# Altium project ESP32_Projet.PrjPcb
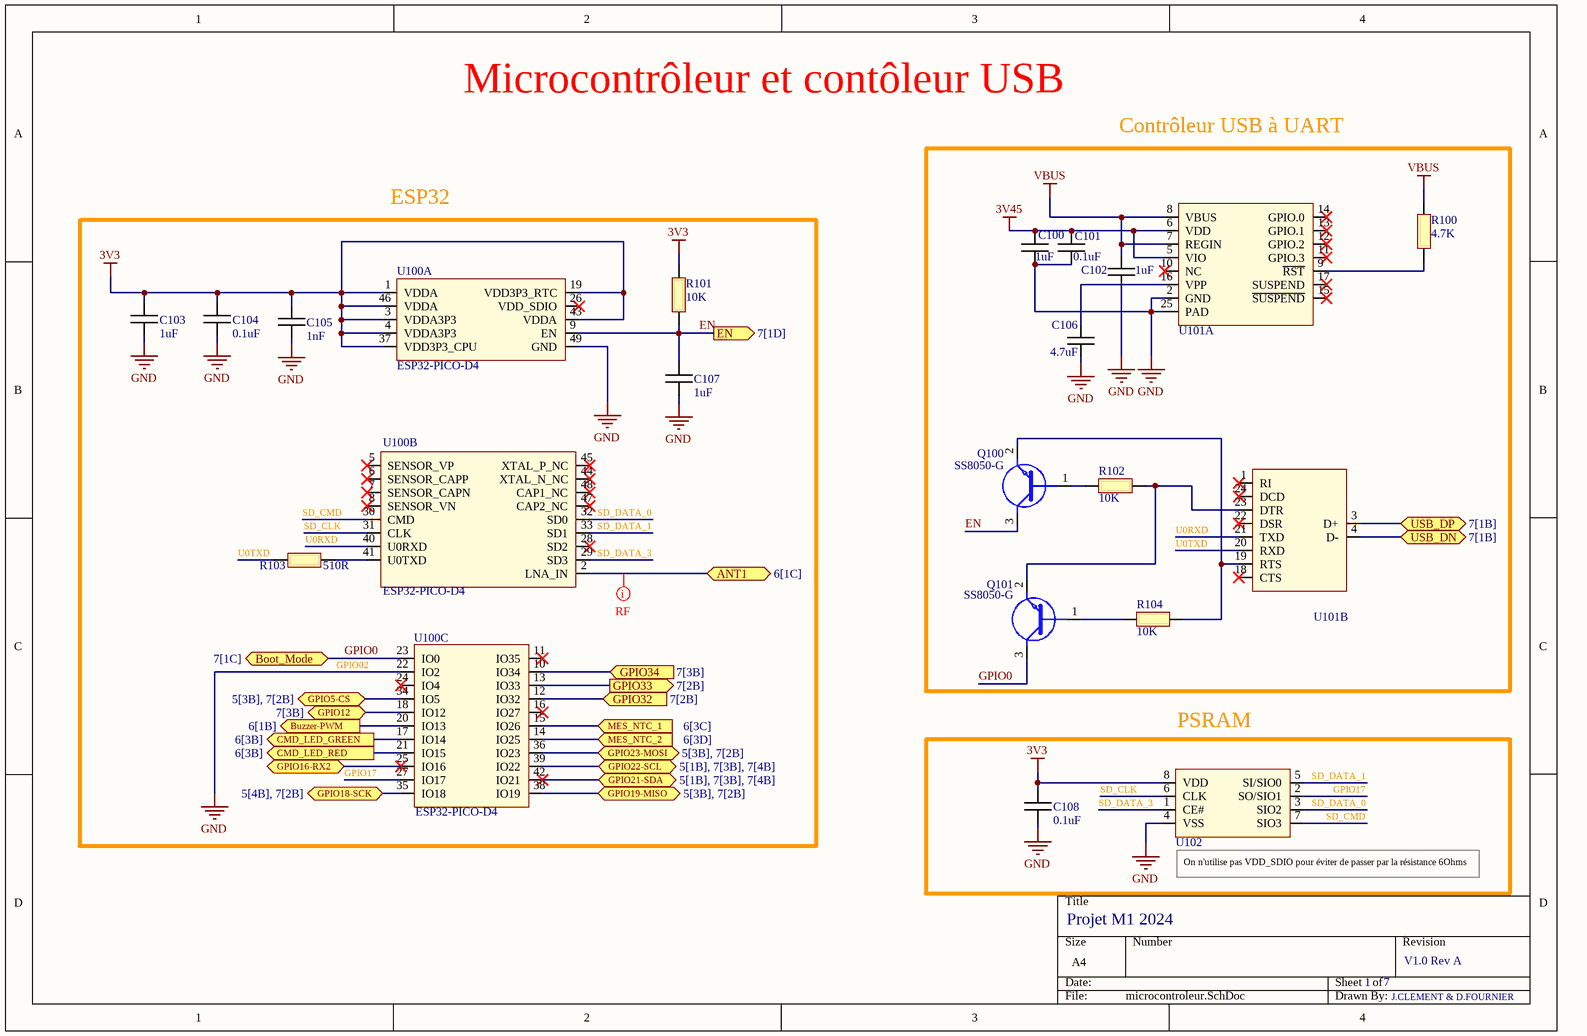
[diagram p0: microcontroleur.SchDoc]
7 sheets, 107 parts. Net scope: flat (ports and power ports of the same name join across sheets).
Board file: ESP32 V1.0.PcbDoc
Sheets:
  microcontroleur.SchDoc
  alimentation.SchDoc
  alim_logique_hard.SchDoc
  logique_hardware.SchDoc
  mesure_&_acquisition.SchDoc
  hmi.SchDoc
  connecteurs.SchDoc

## Sheet microcontroleur.SchDoc: Projet M1 2024
size A4; DrawnBy: J.CLEMENT & D.FOURNIER; DocumentNumber: 1; Revision: V1.0 Rev A; SheetNumber: 1; SheetTotal: 7

### Parts
C100  1uF  [CAPA_0603]
C101  0.1uF  [CAPA_0603]
C102  1uF  [CAPA_0603]
C103  1uF  [CAPA_0603]
C104  0.1uF  [CAPA_0603]
C105  1nF  [CAPA_0603]
C106  4.7uF  [CAPA_0603]
C107  1uF  [CAPA_0603]
C108  0.1uF  [CAPA_0603]
Q100  SS8050-G  [SS8050-G]
Q101  SS8050-G  [SS8050-G]
R100  4.7K  [RES_0603]
R101  10K  [RES_0603]
R102  10K  [RES_0603]
R103  510R  [RES_0603]
R104  10K  [RES_0603]
U100  ESP32-PICO-D4  [PQFN50P700X700X104_HS-49N]  (parts A,B,C of 3)
U101  CP2104-F03-GM  [PQFN50P400X400X80_HS-25N]  (value not drawn)  (parts A,B of 2)
U102  IS66WVS1M8BLL-104NLI  [SOIC127P600X175-8N]  (value not drawn)

### Blocks framed on the sheet
Contrôleur USB à UART: C100-C102 C106 Q100 Q101 R100 R102 R104 U101
ESP32: C103-C105 C107 R101 R103 U100
PSRAM: C108 U102

### Ports
ANT1 (bidir, see 6[1C]), Boot_Mode (bidir, see 7[1C]), Buzzer-PWM (out, see 6[1B]), CMD_LED_GREEN (out, see 6[3B]), CMD_LED_RED (out, see 6[3B]), EN (out, see 7[1D]), GPIO5-CS (bidir, see 5[3B], 7[2B]), GPIO12 (bidir, see 7[3B]), GPIO16-RX2 (bidir), GPIO18-SCK (bidir, see 5[4B], 7[2B]), GPIO19-MISO (bidir, see 5[3B], 7[2B]), GPIO21-SDA (bidir, see 5[1B], 7[3B], 7[4B]), GPIO22-SCL (bidir, see 5[1B], 7[3B], 7[4B]), GPIO23-MOSI (bidir, see 5[3B], 7[2B]), GPIO32 (in, see 7[2B]), GPIO33 (out, see 7[2B]), GPIO34 (in, see 7[3B]), MES_NTC_1 (in, see 6[3C]), MES_NTC_2 (in, see 6[3D]), USB_DN (bidir, see 7[1B]), USB_DP (bidir, see 7[1B])

### Nets
3V3: C103.1 C104.1 C105.1 C108.1 R101.2 U100.1(VDDA) U100.3(VDDA3P3) U100.4(VDDA3P3) U100.19(VDD3P3_RTC) U100.37(VDD3P3_CPU) U100.43(VDDA) U100.46(VDDA) U102.8(VDD)
3V45: C100.1 C101.1 U101.5(VIO) U101.6(VDD)
GND: C100.2 C101.2 C102.2 C103.2 C104.2 C105.2 C106.2 C107.2 C108.2 U100.22(IO2) U100.49(GND) U101.2(GND) U101.25(PAD) U102.4(VSS)
VBUS: C102.1 R100.2 U101.7(REGIN) U101.8(VBUS)
EN: C107.1 Q100.3(C) R101.1 U100.9(EN) ; port EN
GPIO0: Q101.3(C) U100.23(IO0) ; port Boot_Mode
GPIO17: U100.27(IO17) U102.2(SO/SIO1)
SD_CLK: U100.31(CLK) U102.6(CLK)
SD_CMD: U100.30(CMD) U102.7(SIO3)
SD_DATA_0: U100.32(SD0) U102.3(SIO2)
SD_DATA_1: U100.33(SD1) U102.5(SI/SIO0)
SD_DATA_3: U100.29(SD3) U102.1(CE#)
U0RXD: U100.40(U0RXD) U101.21(TXD)
U0TXD: R103.1 U101.20(RXD)
USB_D_N: U101.4(D-) ; port USB_DN
USB_D_P: U101.3(D+) ; port USB_DP
NetB500_4: U100.42(IO21) ; port GPIO21-SDA
NetB500_5: U100.39(IO22) ; port GPIO22-SCL
NetB501_1: U100.34(IO5) ; port GPIO5-CS
NetB501_3: U100.38(IO19) ; port GPIO19-MISO
NetB501_4: U100.35(IO18) ; port GPIO18-SCK
NetC106_1: C106.1 U101.16(VPP)
NetC600_1: U100.2(LNA_IN) ; port ANT1
NetC603_1: U100.15(IO26) ; port MES_NTC_1
NetC605_1: U100.14(IO25) ; port MES_NTC_2
NetD600_1: U100.17(IO14) ; port CMD_LED_GREEN
NetD600_3: U100.21(IO15) ; port CMD_LED_RED
NetJ200_1: U100.12(IO32) ; port GPIO32
NetJ200_2: U100.13(IO33) ; port GPIO33
NetJ200_6: U100.36(IO23) ; port GPIO23-MOSI
NetJ200_9: U100.18(IO12) ; port GPIO12
NetJ200_10: U100.10(IO34) ; port GPIO34
NetQ100_1: Q100.1(B) R102.1
NetQ100_2: Q100.2(E) R104.2 U101.19(RTS)
NetQ101_1: Q101.1(B) R104.1
NetQ101_2: Q101.2(E) R102.2 U101.23(DTR)
NetR100_1: R100.1 U101.9(~{RST})
NetR103_2: R103.2 U100.41(U0TXD)
NetR603_1: U100.20(IO13) ; port Buzzer-PWM
NetU100_25: U100.25(IO16) ; port GPIO16-RX2

Not connected (* = marked no-connect by the designer): U100 5(SENSOR_VP)* 6(SENSOR_CAPP)* 7(SENSOR_CAPN)* 8(SENSOR_VN)* 11(IO35)* 16(IO27)* 24(IO4)* 26(VDD_SDIO)* 28(SD2)* 44(XTAL_N_NC)* 45(XTAL_P_NC)* 47(CAP2_NC)* 48(CAP1_NC)*; U101 1(RI)* 10(NC)* 11(GPIO.3)* 12(GPIO.2)* 13(GPIO.1)* 14(GPIO.0)* 15(~{SUSPEND})* 17(SUSPEND)* 18(CTS)* 22(DSR)* 24(DCD)*

### Layout directives
rule Width Constraint [Pref Impedance = 50.00ohms    Min Impedance = 50.00ohms    Max Impedance = 50.00ohms]: NetC600_1

### Notes on the sheet
- Microcontrôleur et contôleur USB
- (near U100) GPIO02
- (near U102) On n'utilise pas VDD_SDIO pour éviter de passer par la résistance 6Ohms

### Library data of the parts
C100-C108 = Capacitor
  C103: Parameter 1: *
Q100 Q101 = SS8050-G: Bipolar Transistors - BJT NPN TRANSISTOR 1.5A 40V
R100-R104 = Resistor
U100 = ESP32: Système RF sur puce - SoC SIP module ESP32 with 4MByte Flash, Dual Core MCU, Wi-Fi & Bluetooth Combo, LGA48-pin, 7*7mm; Manufacturer 1: Espressif Systems; Supplier 1: Digi-Key; Supplier Part Number 1: 1904-1029-1-ND; Manufacturer Part Number 1: ESP32-PICO-D4
U101 = USBBridge: USB Bridge, USB to UART USB 2.0 UART Interface 24-QFN (4x4); Manufacturer 1: Silicon Labs; Supplier 1: Arrow Electronics; Supplier Part Number 1: CP2104-F03-GM; Manufacturer Part Number 1: CP2104-F03-GM
U102 = SRAM: SRAM 8Mb, SerialRAM, 2.7V-3.6V, 104MHz, 8 pin SOIC 150 mil, RoHS; Manufacturer 1: ISSI; Supplier 1: Digi-Key; Supplier Part Number 1: 706-IS66WVS1M8BLL-104NLI-ND; Manufactuer Part Number 1: IS66WVS1M8BLL-104NLI

## Sheet alimentation.SchDoc: Projet M1 2024
size A4; DrawnBy: J.CLEMENT & D.FOURNIER; Revision: V1.0 Rev A; SheetNumber: 2; SheetTotal: 7
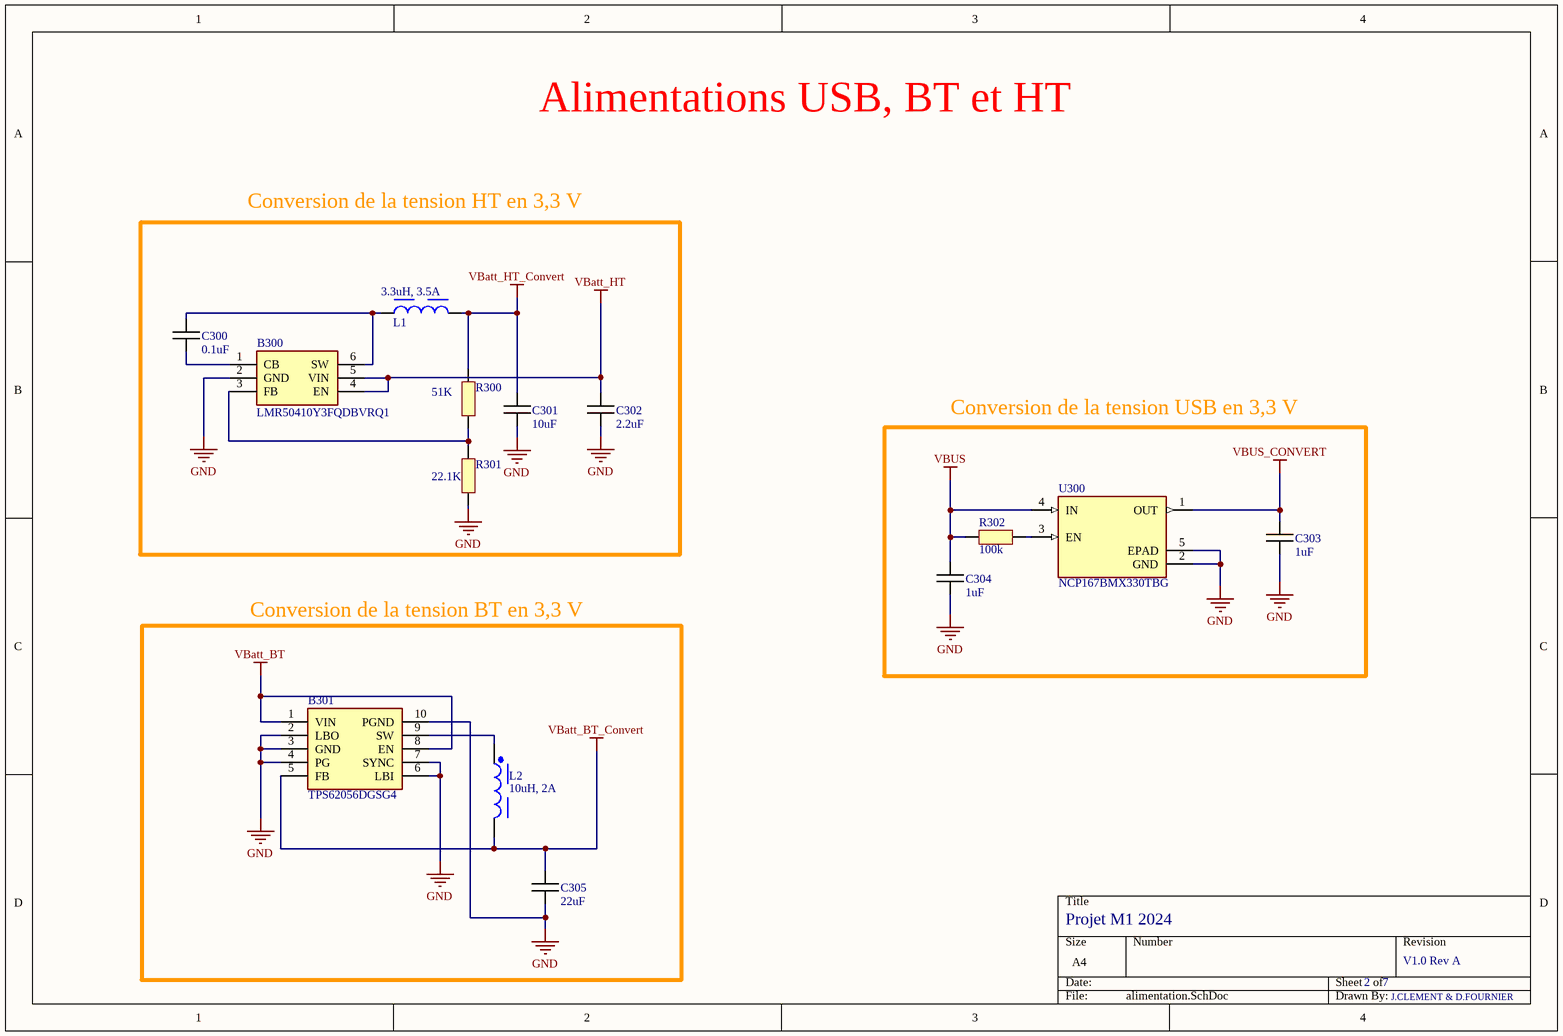
[diagram p1: alimentation.SchDoc]

### Parts
B300  LMR50410Y3FQDBVRQ1  [SOT95P280X145-6N]
B301  TPS62056DGSG4  [SOP50P490X110-10N]
C300  0.1uF  [CAPA_0603]
C301  10uF  [CAPA_0603]
C302  2.2uF  [CAPA_0603]
C303  1uF  [CAPA_0603]
C304  1uF  [CAPA_0603]
C305  22uF  [CAPA_0603]
L1  3.3uH, 3.5A  [WE-LHMI_4020]
L2  10uH, 2A  [WE-PD_7345]
R300  51K  [RES_0603]
R301  22.1K  [RES_0603]
R302  100k  [RES_0603]
U300  NCP167BMX330TBG  [NCP167BMX330TBG]

### Blocks framed on the sheet
Conversion de la tension HT en 3,3 V: B300 C300-C302 L1 R300 R301
Conversion de la tension USB en 3,3 V: C303 C304 R302 U300
Conversion de la tension BT en 3,3 V: B301 C305 L2

### Nets
GND: B300.2(GND) B301.2(LBO) B301.3(GND) B301.4(PG) B301.6(LBI) B301.7(SYNC) B301.10(PGND) C301.2 C302.2 C303.2 C304.2 C305.2 R301.1 U300.2(GND) U300.5(EPAD)
VBatt_BT: B301.1(VIN) B301.8(EN)
VBatt_BT_Convert: B301.5(FB) C305.1 L2.2
VBatt_HT: B300.4(EN) B300.5(VIN) C302.1
VBatt_HT_Convert: C301.1 L1.2 R300.2
VBUS: C304.1 R302.2 U300.4(IN)
VBUS_CONVERT: C303.1 U300.1(OUT)
NetB300_1: B300.1(CB) C300.2
NetB300_3: B300.3(FB) R300.1 R301.2
NetB300_6: B300.6(SW) C300.1 L1.1
NetB301_9: B301.9(SW) L2.1
NetR302_1: R302.1 U300.3(EN)

### Notes on the sheet
- Alimentations USB, BT et HT

### Library data of the parts
B300 = LMR50410Y3FQDBVRQ1: Régulateurs de tension de commutation Automotive qualified SIMPLE SWITCHER 4-V to 36-V, 1-A synchronous step-down converter 6-SOT-23 -40 to 150; Manufacturer_Name: Texas Instruments; Manufacturer_Part_Number: LMR50410Y3FQDBVRQ1; Mouser Part Number: 595-R50410Y3FQDBVRQ1
B301 = TPS62056DGSG4: TEXAS INSTRUMENTS - TPS62056DGSG4 - Synchronous Buck (Step Down) Switching Regulator, Fixed, 2.7V-10Vin, 3.3V/0.8A out, 850kHz, VSSOP-10; Manufacturer_Name: Texas Instruments; Manufacturer_Part_Number: TPS62056DGSG4; Mouser Part Number: 595-TPS62056DGSG4
C300-C305 = Capacitor
L1 = 74437324033: WE-LHMI SMT Power Inductor, size 4020, 3.3uH, 3.5A, 76mOhm; Manufacturer: Wurth Elektronik; Case/Size Code: 4020; DC Resistance: 69mOhm; Saturation Current @ 10%: 2.75A; Saturation Current @ 30%: 5.45A; Self Resonant Frequency: 40MHz; Manufacturer Part Number: 74437324033; Category: Power Inductors; Match Code: WE-LHMI; ComponentLink1Description: Website Link; ComponentLink1URL: https://www.we-online.com/redexpert/article/74437324033?ad; ComponentLink2Description: Datasheet Link; ComponentLink2URL: https://www.we-online.com/redexpert/spec/74437324033?ad; Mount: Surface Mount; Operating Temperature Max: 125°C; Operating Temperature Min: -40°C; Packaging: Tape and Reel; Length: 4.06mm; Width: 4.06mm; Height: 1.8mm; DC Resistance Max: 76mOhm; Inductance: 3.3uH; Performance Rated Current: 3.5A
L2 = 74477710: WE-PD SMT Power Inductor, size 7345, 10uH, 2A, 49mOhm; Manufacturer: Wurth Elektronik; Case/Size Code: 7345; DC Resistance: 45mOhm; Saturation Current: 2.6A; Self Resonant Frequency: 26MHz; Type: Standard; Manufacturer Part Number: 74477710; Category: Power Inductors; Match Code: WE-PD; ComponentLink1Description: Website Link; ComponentLink1URL: https://www.we-online.com/redexpert/article/74477710?ad; ComponentLink2Description: Datasheet Link; ComponentLink2URL: https://www.we-online.com/redexpert/spec/74477710?ad; Mount: Surface Mount; Operating Temperature Max: 125°C; Operating Temperature Min: -40°C; Packaging: Tape and Reel; Length: 7.3mm; Width: 7.3mm; Height: 4.5mm; DC Resistance Max: 49mOhm; Inductance: 10uH; Rated Current: 2A
R300-R302 = Resistor
U300 = NCP167BMX330TBG: Régulateurs de tension LDO LDO 700 MA ULTRA-LOW NOISE 3.3V

## Sheet alim_logique_hard.SchDoc: Projet M1 2024
size A4; DrawnBy: J.CLEMENT & D.FOURNIER; Revision: V1.0 Rev A; SheetNumber: 3; SheetTotal: 7
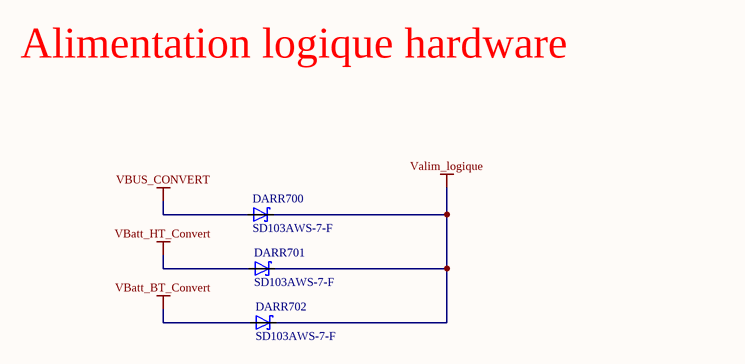
[diagram p2: alim_logique_hard.SchDoc]

### Parts
DARR700  SD103AWS-7-F  [SD103AWS-7-F]
DARR701  SD103AWS-7-F  [SD103AWS-7-F]
DARR702  SD103AWS-7-F  [SD103AWS-7-F]

### Nets
Valim_logique: DARR700.1(C) DARR701.1(C) DARR702.1(C)
VBatt_BT_Convert: DARR702.2(A)
VBatt_HT_Convert: DARR701.2(A)
VBUS_CONVERT: DARR700.2(A)

### Notes on the sheet
- Alimentation logique hardware

### Library data of the parts
DARR700-DARR702 = SD103AWS-7-F: Diode Array 3 Independent Schottky 40V 175mA Surface Mount 6-TSSOP, SC-88, SOT-363

## Sheet logique_hardware.SchDoc: Projet M1 2024
size A4; DrawnBy: J.CLEMENT & D.FOURNIER; Revision: V1.0 Rev A; SheetNumber: 4; SheetTotal: 7
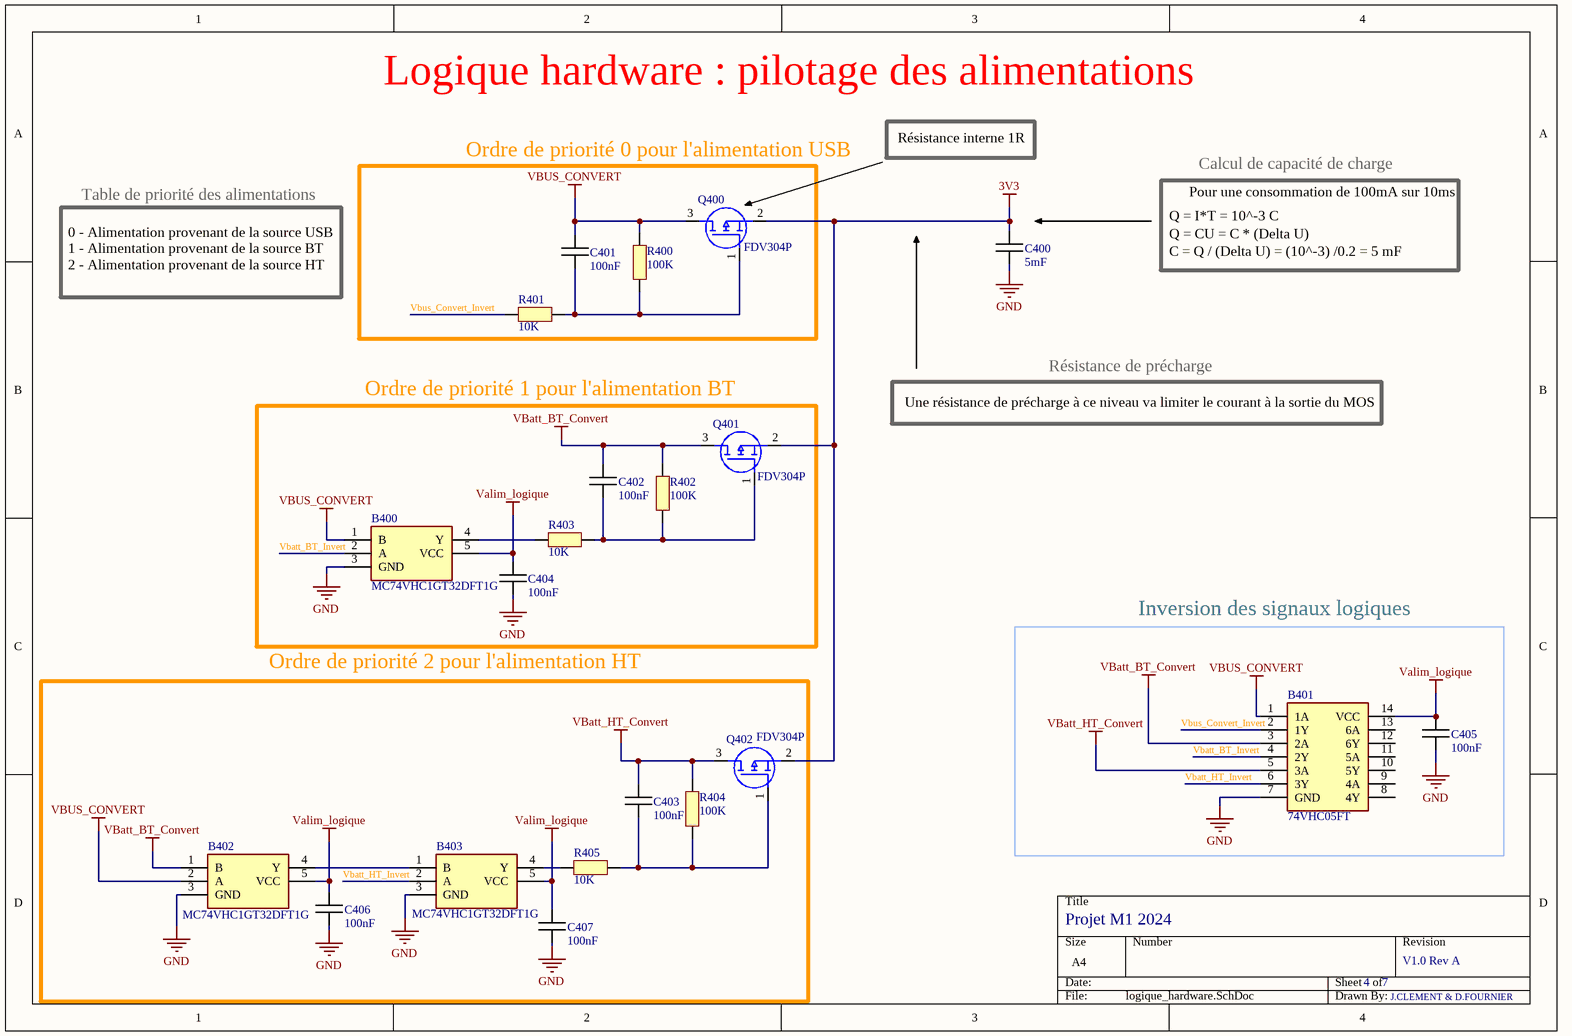
[diagram p3: logique_hardware.SchDoc]

### Parts
B400  MC74VHC1GT32DFT1G  [SOT65P210X110-5N]
B401  74VHC05FT  [SOP65P640X120-14N]
B402  MC74VHC1GT32DFT1G  [SOT65P210X110-5N]
B403  MC74VHC1GT32DFT1G  [SOT65P210X110-5N]
C400  5mF  [CAPA_0603]
C401  100nF  [CAPA_0603]
C402  100nF  [CAPA_0603]
C403  100nF  [CAPA_0603]
C404  100nF  [CAPA_0603]
C405  100nF  [CAPA_0603]
C406  100nF  [CAPA_0603]
C407  100nF  [CAPA_0603]
Q400  FDV304P  [SOT95P251X112-3N]
Q401  FDV304P  [SOT95P251X112-3N]
Q402  FDV304P  [SOT95P251X112-3N]
R400  100K  [RES_0603]
R401  10K  [RES_0603]
R402  100K  [RES_0603]
R403  10K  [RES_0603]
R404  100K  [RES_0603]
R405  10K  [RES_0603]

### Blocks framed on the sheet
Ordre de priorité 0 pour l'alimentation USB: C401 Q400 R400 R401
Ordre de priorité 1 pour l'alimentation BT: B400 C402 C404 Q401 R402 R403
Inversion des signaux logiques: B401 C405
Ordre de priorité 2 pour l'alimentation HT: B402 B403 C403 C406 C407 Q402 R404 R405

### Nets
3V3: C400.1 Q400.2(S) Q401.2(S) Q402.2(S)
GND: B400.3(GND) B401.7(GND) B402.3(GND) B403.3(GND) C400.2 C404.2 C405.2 C406.2 C407.2
Valim_logique: B400.5(VCC) B401.14(VCC) B402.5(VCC) B403.5(VCC) C404.1 C405.1 C406.1 C407.1
VBatt_BT_Convert: B401.3(2A) B402.1(B) C402.1 Q401.3(D) R402.2
VBatt_HT_Convert: B401.5(3A) C403.1 Q402.3(D) R404.2
VBUS_CONVERT: B400.1(B) B401.1(1A) B402.2(A) C401.1 Q400.3(D) R400.2
Vbatt_BT_Invert: B400.2(A) B401.4(2Y)
Vbatt_HT_Invert: B401.6(3Y) B403.2(A)
Vbus_Convert_Invert: B401.2(1Y) R401.1
NetB400_4: B400.4(Y) R403.1
NetB402_4: B402.4(Y) B403.1(B)
NetB403_4: B403.4(Y) R405.1
NetC401_2: C401.2 Q400.1(G) R400.1 R401.2
NetC402_2: C402.2 Q401.1(G) R402.1 R403.2
NetC403_2: C403.2 Q402.1(G) R404.1 R405.2

Not connected (* = marked no-connect by the designer): B401 8(4Y) 9(4A) 10(5Y) 11(5A) 12(6Y) 13(6A)

### Notes on the sheet
- Logique hardware : pilotage des alimentations
- Résistance interne 1R
- Calcul de capacité de charge
- 0 - Alimentation provenant de la source USB
- Table de priorité des alimentations
- Q = I*T = 10^-3 C
- Q = CU = C * (Delta U)
- Pour une consommation de 100mA sur 10ms
- 1 - Alimentation provenant de la source BT
- 2 - Alimentation provenant de la source HT
- C = Q / (Delta U) = (10^-3) /0.2 = 5 mF
- Résistance de précharge
- Une résistance de précharge à ce niveau va limiter le courant à la sortie du MOS

### Library data of the parts
B400 B402 B403 = MC74VHC1GT32DFT1G: Single 2-Input OR Gate, TTL Level; Manufacturer_Name: onsemi; Manufacturer_Part_Number: MC74VHC1GT32DFT1G; Mouser Part Number: 863-C74VHC1GT32DFT1G
B401 = 74VHC05FT: Logic Gates CMOS LOGIC IC INVERTER; Manufacturer_Name: Toshiba; Manufacturer_Part_Number: 74VHC05FT; Mouser Part Number: 757-74VHC05FT
C400-C407 = Capacitor
Q400-Q402 = FDV304P: ON SEMICONDUCTOR - FDV304P - Power MOSFET, P Channel, 25 V, 460 mA, 1.22 ohm, SOT-23, Surface Mount; Manufacturer_Name: onsemi; Geometry.Height: 1.12mm; Manufacturer_Part_Number: FDV304P; Mouser Part Number: 512-FDV304P; Mouser Price/Stock: https://www.mouser.co.uk/ProductDetail/onsemi-Fairchild/FDV304P?qs=FOlmdCx%252BAA1BAlCQZu888w%3D%3D; Arrow Part Number: FDV304P; Arrow Price/Stock: https://www.arrow.com/en/products/fdv304p/on-semiconductor?utm_currency=USD&region=europe; Datasheet Link: https://componentsearchengine.com/Datasheets/2/FDV304P.pdf
R400-R405 = Resistor

## Sheet mesure_&_acquisition.SchDoc: Projet M1 2024
size A4; DrawnBy: J.CLEMENT & D.FOURNIER; Revision: V1.0 Rev A; SheetNumber: 5; SheetTotal: 7
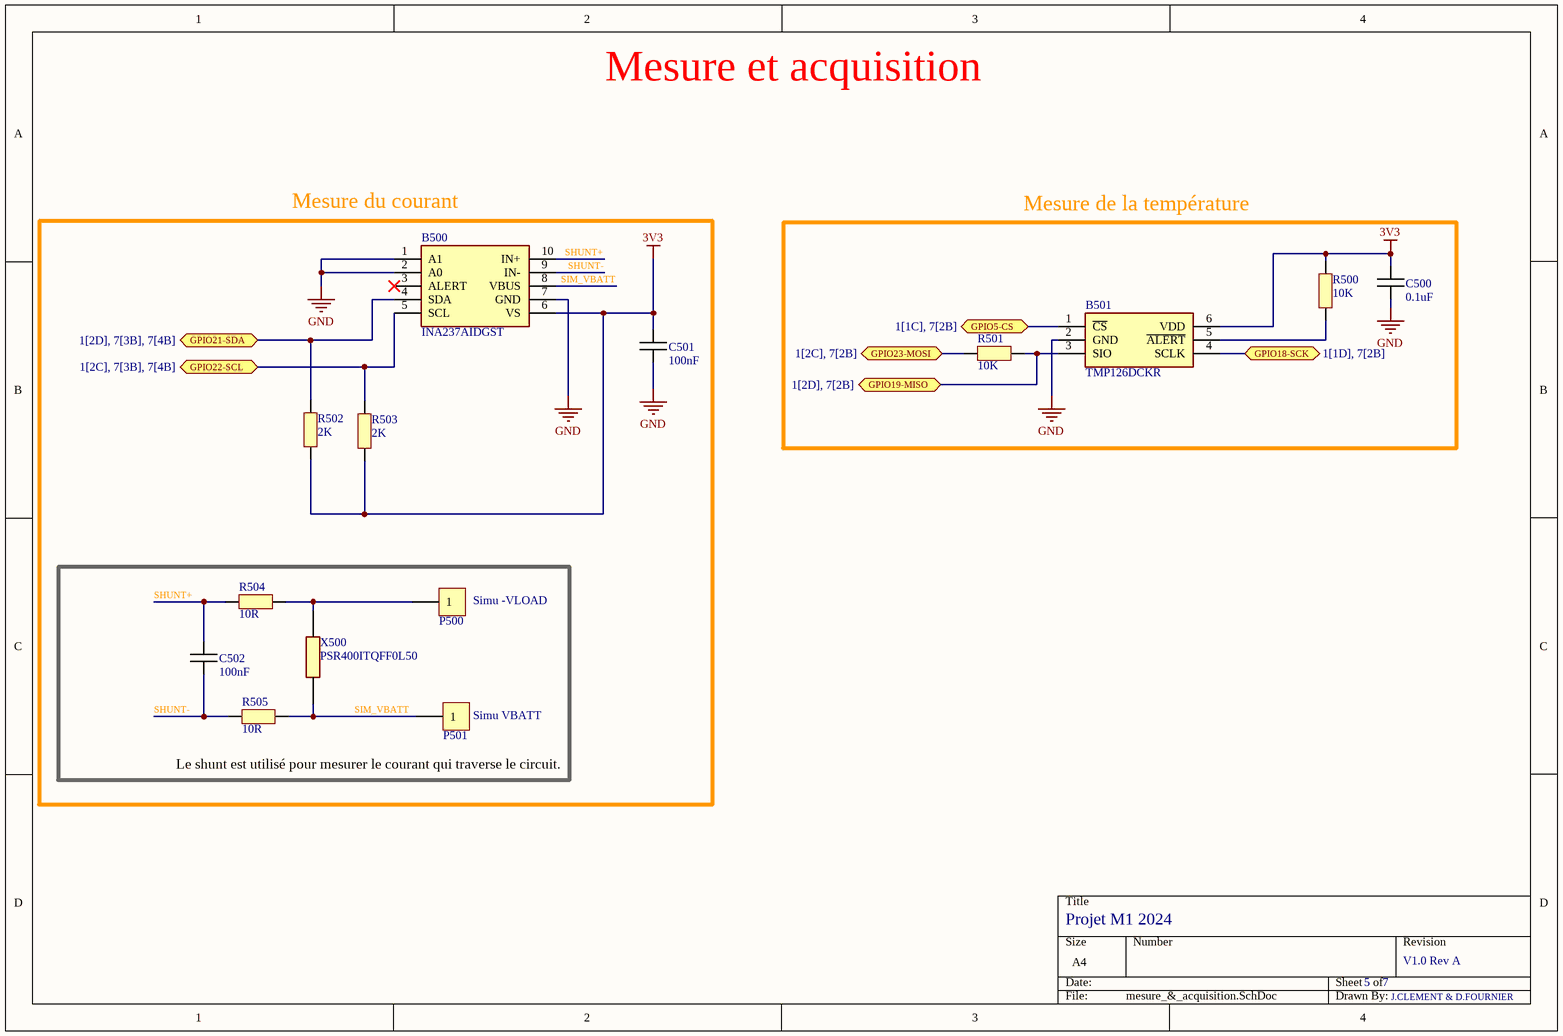
[diagram p4: mesure_&_acquisition.SchDoc]

### Parts
B500  INA237AIDGST  [SOP50P490X110-10N]
B501  TMP126DCKR  [SOT65P210X110-6N]
C500  0.1uF  [CAPA_0603]
C501  100nF  [CAPA_0603]
C502  100nF  [CAPA_0603]
P500  Plage CMS 10x5  [Plage CMS 10x5]  (value not drawn)  (no BOM)
P501  Plage CMS 10x5  [Plage CMS 10x5]  (value not drawn)  (no BOM)
R500  10K  [RES_0603]
R501  10K  [RES_0603]
R502  2K  [RES_0603]
R503  2K  [RES_0603]
R504  10R  [RES_0603]
R505  10R  [RES_0603]
X500  PSR400ITQFF0L50  [RESC10052X200N]

### Blocks framed on the sheet
Mesure du courant: B500 C501 C502 P500 P501 R502-R505 X500
Mesure de la température: B501 C500 R500 R501

### Ports
GPIO5-CS (bidir, see 1[1C], 7[2B]), GPIO18-SCK (bidir, see 1[1D], 7[2B]), GPIO19-MISO (bidir, see 1[2D], 7[2B]), GPIO21-SDA (bidir, see 1[2D], 7[3B], 7[4B]), GPIO22-SCL (bidir, see 1[2C], 7[3B], 7[4B]), GPIO23-MOSI (bidir, see 1[2C], 7[2B])

### Nets
3V3: B500.6(VS) B501.6(VDD) C500.1 C501.1 R500.2 R502.1 R503.1
GND: B500.1(A1) B500.2(A0) B500.7(GND) B501.2(GND) C500.2 C501.2
SHUNT+: B500.10(IN+) C502.1 R504.1
SHUNT-: B500.9(IN-) C502.2 R505.1
SIM_VBATT: B500.8(VBUS) P501.1 R505.2 X500.1
NetB500_4: B500.4(SDA) R502.2 ; port GPIO21-SDA
NetB500_5: B500.5(SCL) R503.2 ; port GPIO22-SCL
NetB501_1: B501.1(~{CS}) ; port GPIO5-CS
NetB501_3: B501.3(SIO) R501.2 ; port GPIO19-MISO
NetB501_4: B501.4(SCLK) ; port GPIO18-SCK
NetB501_5: B501.5(~{ALERT}) R500.1
NetJ200_6: R501.1 ; port GPIO23-MOSI
NetP500_1: P500.1 R504.2 X500.2

Not connected (* = marked no-connect by the designer): B500 3(ALERT)*

### Notes on the sheet
- Mesure et acquisition
- (near P500) Simu -VLOAD
- (near P501) Simu VBATT
- Le shunt est utilisé pour mesurer le courant qui traverse le circuit.

### Library data of the parts
B500 = INA237AIDGST: Current Sense Amplifiers 85-V, 16-bit, I2C output current/voltage/power monitor with alert 10-VSSOP -40 to 125; Manufacturer_Name: Texas Instruments; Manufacturer_Part_Number: INA237AIDGST; Mouser Part Number: 595-INA237AIDGST
B501 = TMP126DCKR: Board Mount Temperature Sensors +/-0.25 C SPI temperature sensor with 175 C operation, CRC and slew-rate alert; Manufacturer_Name: Texas Instruments; Manufacturer_Part_Number: TMP126DCKR; Mouser Part Number: 595-TMP126DCKR
C500-C502 = Capacitor
P500 P501 = Plage CMS 10x5: Plage de report CMS 10x5mm; PN: L30; Value: Plage CMS 10x5; Footprint_statut: ok
R500-R505 = Resistor
X500 = PSR400ITQFF0L50: ROHM - PSR400ITQFF0L50 - SMD Current Sense Resistor, 500 ohm, PSR Series, 3921 [1052 Metric], 4 W, +/- 1%, Metal Strip; Manufacturer_Name: ROHM Semiconductor; Geometry.Height: 2mm; Manufacturer_Part_Number: PSR400ITQFF0L50; Mouser Part Number: 755-PSR400ITQFF0L50; Mouser Price/Stock: https://www.mouser.co.uk/ProductDetail/ROHM-Semiconductor/PSR400ITQFF0L50?qs=493kPxzlxfLaT1w5Mo%252BtHg%3D%3D; Arrow Part Number: *; Arrow Price/Stock: *; Datasheet Link: https://componentsearchengine.com/Datasheets/2/PSR400ITQFF0L50.pdf

## Sheet hmi.SchDoc: Projet M1 2024
size A4; DrawnBy: J.CLEMENT & D.FOURNIER; Revision: V1.0 Rev A; SheetNumber: 6; SheetTotal: 7
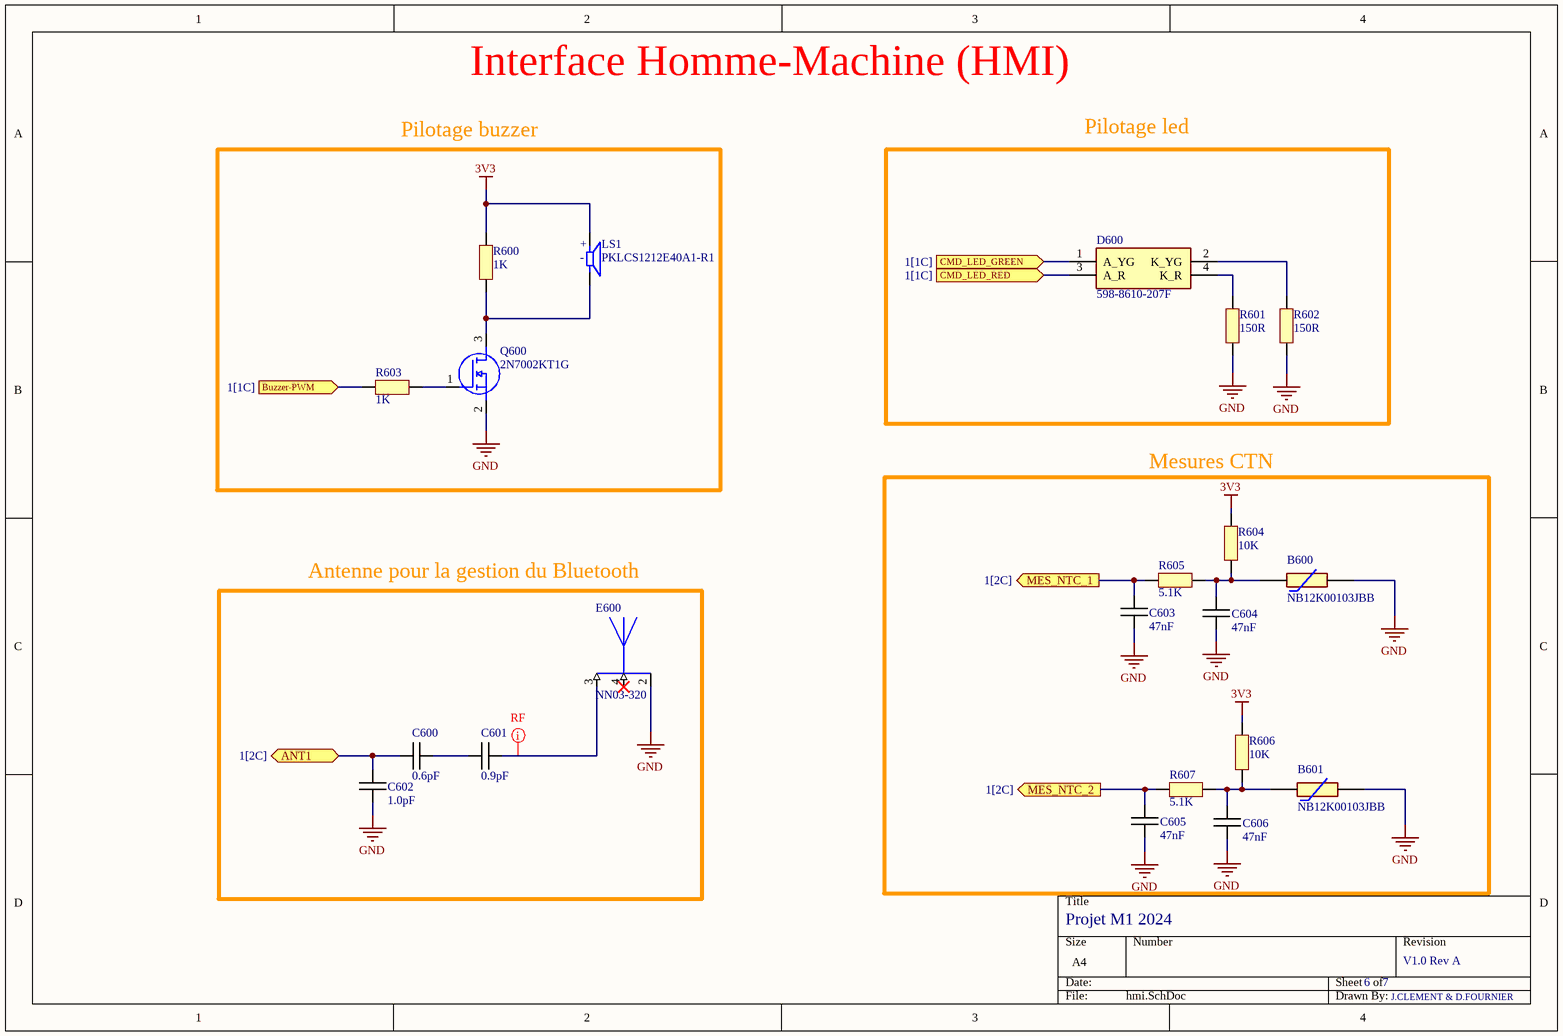
[diagram p5: hmi.SchDoc]

### Parts
B600  NB12K00103JBB  [RESC2212X50N]
B601  NB12K00103JBB  [RESC2212X50N]
C600  0.6pF  [CAPA_0603]
C601  0.9pF  [CAPA_0603]
C602  1.0pF  [CAPA_0603]
C603  47nF  [CAPA_0603]
C604  47nF  [CAPA_0603]
C605  47nF  [CAPA_0603]
C606  47nF  [CAPA_0603]
D600  598-8610-207F  [5988610207F]
E600  NN03-320  [XCVR_NN03-320]
LS1  PKLCS1212E40A1-R1  [SPKR_PKLCS1212E40A1-R1]
Q600  2N7002KT1G  [SOT96P237X111-3N]
R600  1K  [RES_0603]
R601  150R  [RES_0603]
R602  150R  [RES_0603]
R603  1K  [RES_0603]
R604  10K  [RES_0603]
R605  5.1K  [RES_0603]
R606  10K  [RES_0603]
R607  5.1K  [RES_0603]

### Blocks framed on the sheet
Pilotage buzzer: LS1 Q600 R600 R603
Pilotage led: D600 R601 R602
Mesures CTN: B600 B601 C603-C606 R604-R607
Antenne pour la gestion du Bluetooth: C600-C602 E600

### Ports
ANT1 (bidir, see 1[2C]), Buzzer-PWM (in, see 1[1C]), CMD_LED_GREEN (in, see 1[1C]), CMD_LED_RED (in, see 1[1C]), MES_NTC_1 (out, see 1[2C]), MES_NTC_2 (out, see 1[2C])

### Nets
3V3: LS1.P R600.2 R604.2 R606.2
GND: B600.2 B601.2 C602.2 C603.2 C604.2 C605.2 C606.2 E600.2(GROUND) Q600.2(S) R601.1 R602.1
NetB600_1: B600.1 C604.1 R604.1 R605.2
NetB601_1: B601.1 C606.1 R606.1 R607.2
NetC600_1: C600.1 C602.1 ; port ANT1
NetC600_2: C600.2 C601.2
NetC601_1: C601.1 E600.3(FEED_BLUETOOTH)
NetC603_1: C603.1 R605.1 ; port MES_NTC_1
NetC605_1: C605.1 R607.1 ; port MES_NTC_2
NetD600_1: D600.1(A_YG) ; port CMD_LED_GREEN
NetD600_2: D600.2(K_YG) R602.2
NetD600_3: D600.3(A_R) ; port CMD_LED_RED
NetD600_4: D600.4(K_R) R601.2
NetLS1_N: LS1.N Q600.3(D) R600.1
NetQ600_1: Q600.1(G) R603.2
NetR603_1: R603.1 ; port Buzzer-PWM

Not connected (* = marked no-connect by the designer): E600 4(FEED_GNSS)*

### Layout directives
rule Width Constraint [Pref Impedance = 50,00ohms    Min Impedance = 50,00ohms    Max Impedance = 50,00ohms]: NetC601_1

### Notes on the sheet
- Interface Homme-Machine (HMI)
- (in symbol PKLCS1212E40A1-R1) +; -

### Library data of the parts
B600 B601 = NB12K00103JBB: NTC SMD Thermistor, NB12K, 10K, 5% AVX 10k 0805 Protection NTC Thermistor, 5s, 2 x 1.25 x 1.3mm; Manufacturer_Name: Kyocera AVX; Geometry.Height: 0.5mm; Manufacturer_Part_Number: NB12K00103JBB; Mouser Part Number: 581-NB12K00103JBB; Mouser Price/Stock: https://www.mouser.co.uk/ProductDetail/AVX/NB12K00103JBB/?qs=4%252B6%252BTdINQeDPvI%252BQUQjJ3Q%3D%3D; Arrow Part Number: NB12K00103JBB; Arrow Price/Stock: https://www.arrow.com/en/products/nb12k00103jbb/avx; Datasheet Link: https://datasheet.datasheetarchive.com/originals/distributors/Datasheets-DGA6/551314.pdf
C600-C606 = Capacitor
D600 = 598-8610-207F: Standard LEDs - SMD Red/Green WC 80/50mcd 645/570nm; Manufacturer_Name: Dialight; Geometry.Height: 0.8mm; Manufacturer_Part_Number: 598-8610-207F; Mouser Part Number: 645-598-8610-207F; Mouser Price/Stock: https://www.mouser.co.uk/ProductDetail/Dialight/598-8610-207F?qs=7JStj%2FjQ2SFuCjosqwklHQ%3D%3D; Arrow Part Number: 598-8610-207F; Arrow Price/Stock: https://www.arrow.com/en/products/598-8610-207f/dialight?region=nac; Datasheet Link: https://media.digikey.com/pdf/Data%20Sheets/Dialight%20PDFs/598%20Series%201210%20Pkg%20Bi-Color.pdf
E600 = NN03-320: Dual port antenna booster for GNSS, Bluetooth, 5G and UWB (1561 - 1606MHz, 2400 - 2500MHz, 3400 - 3800MHz, 3100 - 4800MHz and 6000 - 10600 MHz), signal booster; Manufacturer_Name: Ignion; Manufacturer_Part_Number: NN03-320; Mouser Part Number: 128-NN03-320
LS1 = PKLCS1212E40A1-R1: Buzzers Transducer, Externally Driven Piezo 1.5V 2kHz 70dB @ 1.5V, 10cm Surface Mount Solder Pads; MF: Murata Electronics; Value: *; MP: PKLCS1212E40A1-R1; Package: None; Availability: Unavailable; Price: None
Q600 = 2N7002KT1G: MOSFET N-Ch 60V 380mA Small Signal SOT23 ON Semiconductor 2N7002KT1G N-channel MOSFET Transistor, 380 mA, 60 V, 3-Pin SOT-23; Manufacturer_Name: onsemi; Geometry.Height: 1.11mm; Manufacturer_Part_Number: 2N7002KT1G; Mouser Part Number: 863-2N7002KT1G; Mouser Price/Stock: https://www.mouser.co.uk/ProductDetail/onsemi/2N7002KT1G?qs=Jh7l0IbPjifUiTytu%252BGGDQ%3D%3D; Arrow Part Number: 2N7002KT1G; Arrow Price/Stock: https://www.arrow.com/en/products/2n7002kt1g/on-semiconductor?utm_currency=USD&region=nac; Datasheet Link: http://www.onsemi.com/pub/Collateral/2N7002K-D.PDF
R600-R607 = Resistor

## Sheet connecteurs.SchDoc: Projet M1 2024
size A4; DrawnBy: J.CLEMENT & D.FOURNIER; DocumentNumber: 2; Revision: V1.0 Rev A; SheetNumber: 7; SheetTotal: 7
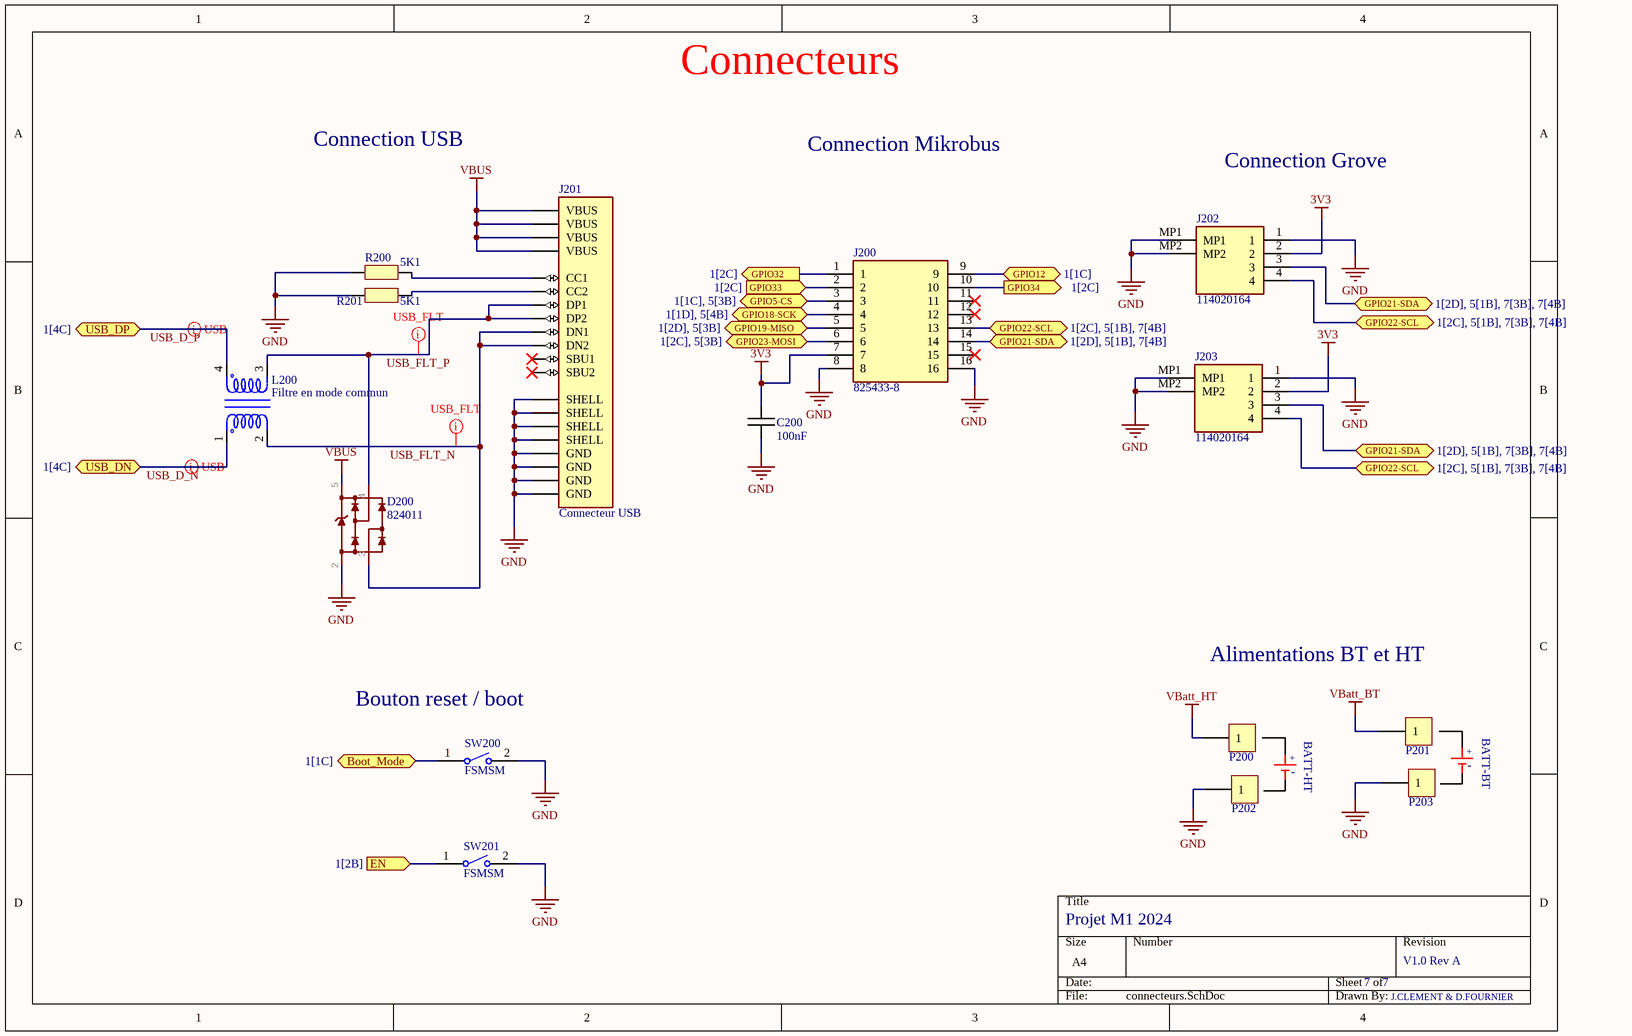
[diagram p6: connecteurs.SchDoc]

### Parts
C200  100nF  [CAPA_0603]
D200  824011  [SOT23-5]
J200  825433-8  [Connect-Mikrobus]
J201  Connecteur USB  [USB4085-GF-A]
J202  114020164  [114020164]
J203  114020164  [114020164]
L200  Filtre en mode commun  [WE-CNSW-1206]
P200  Plage CMS 10x5  [Plage CMS 10x5]  (value not drawn)  (no BOM)
P201  Plage CMS 10x5  [Plage CMS 10x5]  (value not drawn)  (no BOM)
P202  Plage CMS 10x5  [Plage CMS 10x5]  (value not drawn)  (no BOM)
P203  Plage CMS 10x5  [Plage CMS 10x5]  (value not drawn)  (no BOM)
R200  5K1  [RES_0603]
R201  5K1  [RES_0603]
SW200  FSMSM  [TECO-FSMSM-2_V]
SW201  FSMSM  [TECO-FSMSM-2_V]

### Ports
Boot_Mode (bidir, see 1[1C]), EN (in, see 1[2B]), GPIO5-CS (bidir, see 1[1C], 5[3B]), GPIO12 (bidir, see 1[1C]), GPIO18-SCK (bidir, see 1[1D], 5[4B]), GPIO19-MISO (bidir, see 1[2D], 5[3B]), GPIO21-SDA (bidir, see 1[2D], 5[1B], 7[3B], 7[4B]), GPIO21-SDA (bidir, see 1[2D], 5[1B], 7[4B]), GPIO22-SCL (bidir, see 1[2C], 5[1B], 7[3B], 7[4B]), GPIO22-SCL (bidir, see 1[2C], 5[1B], 7[4B]), GPIO23-MOSI (bidir, see 1[2C], 5[3B]), GPIO32 (out, see 1[2C]), GPIO33 (in, see 1[2C]), GPIO34 (out, see 1[2C]), USB_DN (bidir, see 1[4C]), USB_DP (bidir, see 1[4C])

### Nets
3V3: C200.1 J200.7 J202.2 J203.2
GND: C200.2 D200.2(GND) J200.8 J200.16 J201.A1(GND) J201.A12(GND) J201.B1(GND) J201.B12(GND) J201.S1(SHELL) J201.S2(SHELL) J201.S3(SHELL) J201.S4(SHELL) J202.1 J202.MP1 J202.MP2 J203.1 J203.MP1 J203.MP2 P202.1 P203.1 R200.1 R201.1 SW200.2 SW201.2
VBatt_BT: P201.1
VBatt_HT: P200.1
VBUS: D200.5(VDD) J201.A4(VBUS) J201.A9(VBUS) J201.B4(VBUS) J201.B9(VBUS)
EN: SW201.1 ; port EN
GPIO0: SW200.1 ; port Boot_Mode
USB_D_N: L200.1 ; port USB_DN
USB_D_P: L200.4 ; port USB_DP
USB_FLT_N: D200.3 J201.A7(DN1) J201.B7(DN2) L200.2
USB_FLT_P: D200.4 J201.A6(DP1) J201.B6(DP2) L200.3
NetB500_4: J200.14 J202.3 J203.3 ; port GPIO21-SDA
NetB500_5: J200.13 J202.4 J203.4 ; port GPIO22-SCL
NetB501_1: J200.3 ; port GPIO5-CS
NetB501_3: J200.5 ; port GPIO19-MISO
NetB501_4: J200.4 ; port GPIO18-SCK
NetJ200_1: J200.1 ; port GPIO32
NetJ200_2: J200.2 ; port GPIO33
NetJ200_6: J200.6 ; port GPIO23-MOSI
NetJ200_9: J200.9 ; port GPIO12
NetJ200_10: J200.10 ; port GPIO34
NetJ201_A5: J201.A5(CC1) R200.2
NetJ201_B5: J201.B5(CC2) R201.2

Not connected (* = marked no-connect by the designer): J200 11* 12* 15*; J201 A8(SBU1)* B8(SBU2)*

### Layout directives
differential pair; rule Differential Pairs Routing [Pref Gap = 0.127mm    Min Gap  = 0.127mm    Max Gap  = 0.127mmPref Width = 0.22mm    Min Width  = 0.136mm    Max Width  = 0.22mm]: USB_D_N, USB_D_P, USB_FLT_N, USB_FLT_P

### Notes on the sheet
- Connecteurs
- Connection USB
- Connection Mikrobus
- Connection Grove
- (near SW200) Bouton reset / boot
- Alimentations BT et HT
- +
- -
- BATT-HT
- BATT-BT

### Library data of the parts
C200 = Capacitor
D200 = 824011: TVS Diode Array WE-TVS, High Speed Series  - Low capazity - No leakage current - Low clamping voltage - high ESD voltage protection  -- USB 1.0 - 2.0
J200 = Connect-Mikrobus: Headers & Wire Housings 8P double for connection mikrobus; Manufacturer_Name: TE Connectivity; Manufacturer_Part_Number: 825433-8; Mouser Part Number: 571-825433-8
J201 = USB4085-GF-A: Connecteurs USB USB Type C, 2.0, Rec, TH , G/F, RA , Top Mnt, T & R
J202 J203 = 114020164: Seeed Studio Accessories Grove Female Header - SMD-4P-2.0mm-90D-20Pcs; Manufacturer_Name: Seeed Studio; Manufacturer_Part_Number: 114020164; Mouser Part Number: 713-114020164
L200 = 744232090: Bobines / filtres en mode commun WE-CNSW 1206 370mA 90Ohm 100MHz AECQ200
P200-P203 = Plage CMS 10x5_1: Plage de report CMS 10x5mm; PN: L30; Value: Plage CMS 10x5; Footprint_statut: ok
R200 R201 = Resistor
SW200 SW201 = CMP-2000-07511-1: FSMSM Push Button Switch, 50 mA, -35 to 85 degC, 2-Pin SMD, RoHS, Bulk; Manufacturer: TE Connectivity; Actuator Length: 1.07mm; Electrical Life: 20000Cycles; Actuator Material: Polyamide; Current Rating: 50mA; Illumination Type: Illuminated; Voltage Rating (DC): 24V; Contact Resistance: 100mOhm; Case\/Package: SMD/SMT; Operating Force: 180gf; Switch Travel: 0.25mm; Max Voltage Rating (DC): 12V; Throw Configuration: SPST; Packaging: LoosePiece; Max Operating Temperature: 85degC; ELV: Compliant; Package Description: 2-Pin Surface Mount Device, Body 6 x 3.5 mm, Pitch 9.19 mm; RoHSCompliant: true; Manufacturer URL: http://www.te.com/; Contact Plating: Silver; Contact Material: Brass; Mounting Technology: SurfaceMount; Contact Current Rating: 50mA; Datasheet Version: Rev. C2, 08/2014; Datasheet URL: http://www.te.com/commerce/DocumentDelivery/DDEController?Action=showdoc&DocId=Customer+Drawing%7F1437566-3%7FC2%7Fpdf%7FEnglish%7FENG_CD_1437566-3_C2_1437566_3_1_c.dwg.pdf%7F1437566-3; Mechanical Life: 20000Cycles; Package Reference: FSMSM; REACH SVHC: Unknown; Orientation: Straight; Min Operating Temperature: -35degC; Lead Free: LeadFree; Termination: GullWing; Package Quantity: 1000; Mount: SurfaceMount

## Nets that join several sheets
3V3: microcontroleur (13 pins), logique_hardware (C400.1 Q400.2 Q401.2 Q402.2), mesure_&_acquisition (7 pins), hmi (LS1.P R600.2 R604.2 R606.2), connecteurs (C200.1 J200.7 J202.2 J203.2)
GND: microcontroleur (14 pins), alimentation (15 pins), logique_hardware (9 pins), mesure_&_acquisition (6 pins), hmi (11 pins), connecteurs (24 pins)
Valim_logique: alim_logique_hard (DARR700.1 DARR701.1 DARR702.1), logique_hardware (8 pins)
VBatt_BT: alimentation (B301.1 B301.8), connecteurs (P201.1)
VBatt_BT_Convert: alimentation (B301.5 C305.1 L2.2), alim_logique_hard (DARR702.2), logique_hardware (5 pins)
VBatt_HT: alimentation (B300.4 B300.5 C302.1), connecteurs (P200.1)
VBatt_HT_Convert: alimentation (C301.1 L1.2 R300.2), alim_logique_hard (DARR701.2), logique_hardware (B401.5 C403.1 Q402.3 R404.2)
VBUS: microcontroleur (C102.1 R100.2 U101.7 U101.8), alimentation (C304.1 R302.2 U300.4), connecteurs (5 pins)
VBUS_CONVERT: alimentation (C303.1 U300.1), alim_logique_hard (DARR700.2), logique_hardware (6 pins)
EN: microcontroleur (C107.1 Q100.3 R101.1 U100.9), connecteurs (SW201.1)
GPIO0: microcontroleur (Q101.3 U100.23), connecteurs (SW200.1)
NetB500_4: microcontroleur (U100.42), mesure_&_acquisition (B500.4 R502.2), connecteurs (J200.14 J202.3 J203.3)
NetB500_5: microcontroleur (U100.39), mesure_&_acquisition (B500.5 R503.2), connecteurs (J200.13 J202.4 J203.4)
NetB501_1: microcontroleur (U100.34), mesure_&_acquisition (B501.1), connecteurs (J200.3)
NetB501_3: microcontroleur (U100.38), mesure_&_acquisition (B501.3 R501.2), connecteurs (J200.5)
NetB501_4: microcontroleur (U100.35), mesure_&_acquisition (B501.4), connecteurs (J200.4)
NetC600_1: microcontroleur (U100.2), hmi (C600.1 C602.1)
NetC603_1: microcontroleur (U100.15), hmi (C603.1 R605.1)
NetC605_1: microcontroleur (U100.14), hmi (C605.1 R607.1)
NetD600_1: microcontroleur (U100.17), hmi (D600.1)
NetD600_3: microcontroleur (U100.21), hmi (D600.3)
NetJ200_1: microcontroleur (U100.12), connecteurs (J200.1)
NetJ200_2: microcontroleur (U100.13), connecteurs (J200.2)
NetJ200_6: microcontroleur (U100.36), mesure_&_acquisition (R501.1), connecteurs (J200.6)
NetJ200_9: microcontroleur (U100.18), connecteurs (J200.9)
NetJ200_10: microcontroleur (U100.10), connecteurs (J200.10)
NetR603_1: microcontroleur (U100.20), hmi (R603.1)
USB_D_N: microcontroleur (U101.4), connecteurs (L200.1)
USB_D_P: microcontroleur (U101.3), connecteurs (L200.4)

## Assembly variants
rev A: not fitted C400